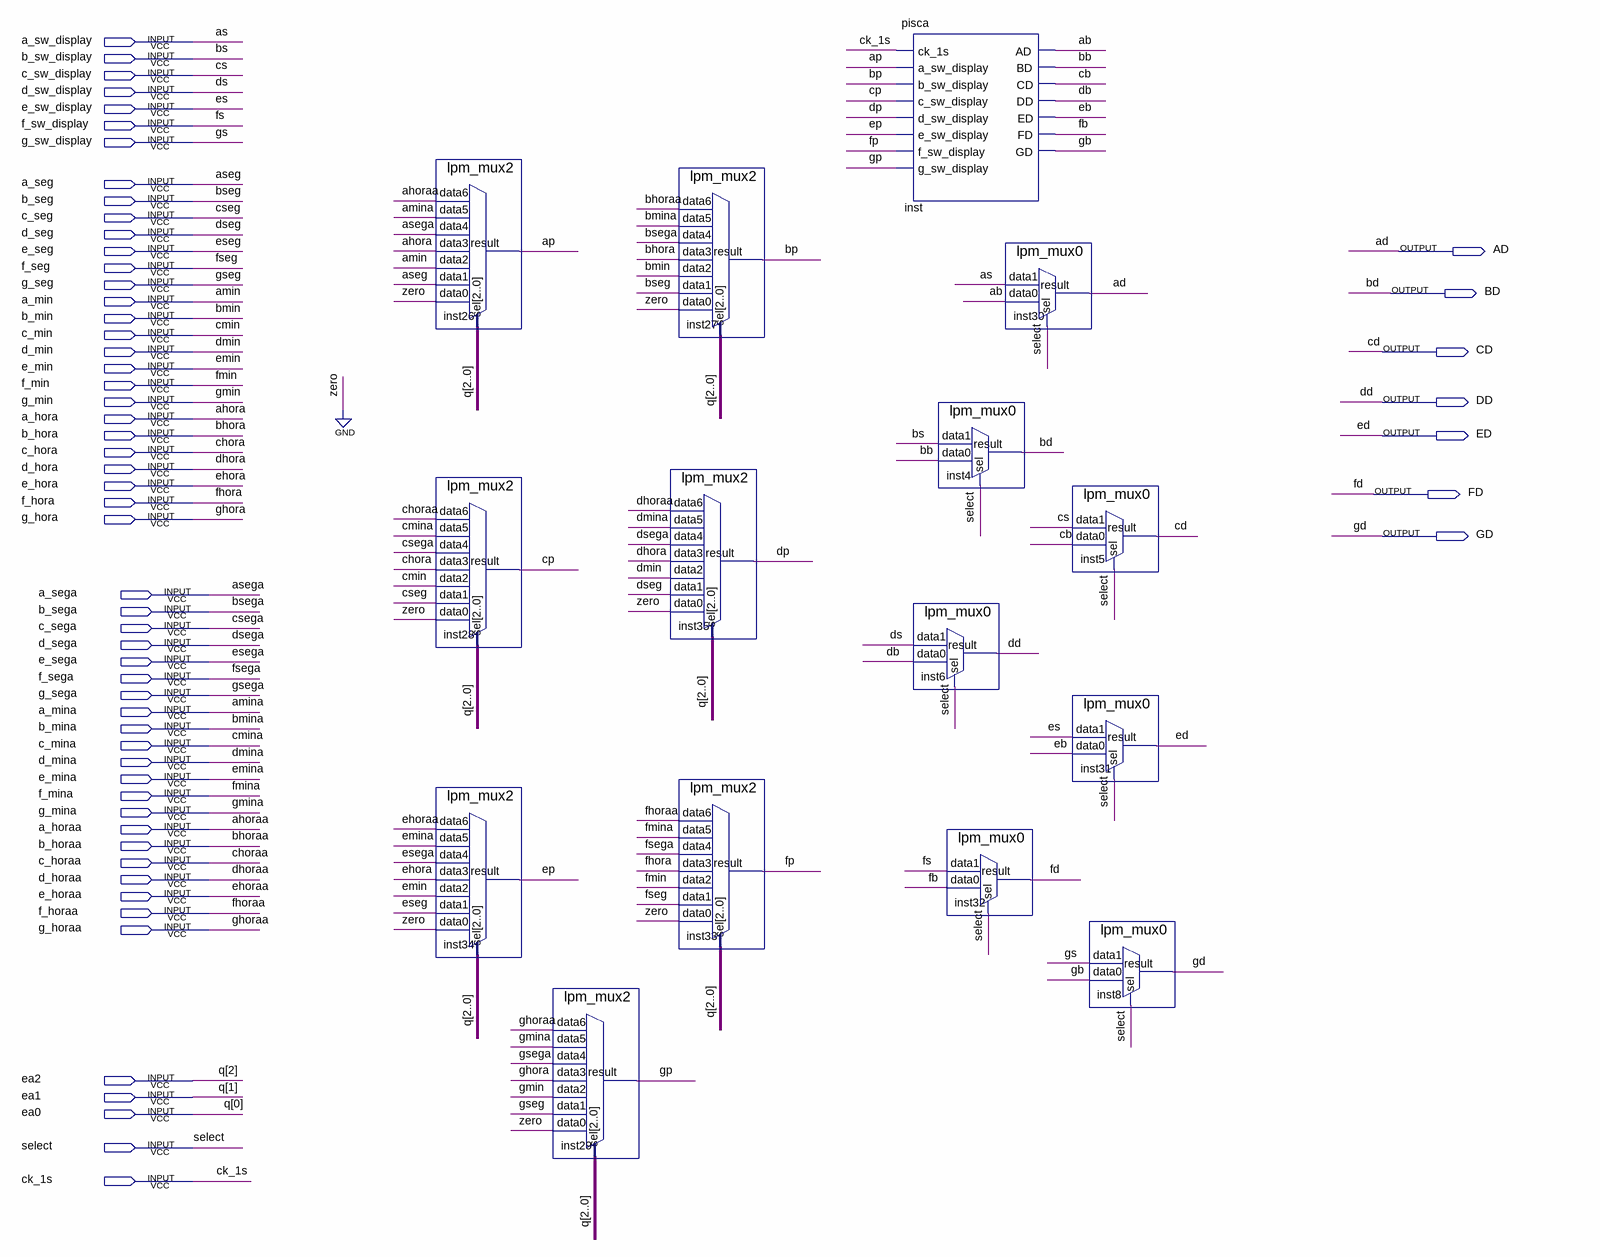
[diagram p0: schematic sheet]
// Quartus schematic select_display0_1.bdf as structural Verilog: 15 symbols, 61 pins
module select_display0_1 (
  input  a_sw_display,
  input  b_sw_display,
  input  c_sw_display,
  input  d_sw_display,
  input  e_sw_display,
  input  f_sw_display,
  input  g_sw_display,
  input  a_seg,
  input  b_seg,
  input  c_seg,
  input  d_seg,
  input  e_seg,
  input  f_seg,
  input  g_seg,
  input  a_min,
  input  b_min,
  input  c_min,
  input  d_min,
  input  e_min,
  input  f_min,
  input  g_min,
  input  a_hora,
  input  b_hora,
  input  c_hora,
  input  d_hora,
  input  e_hora,
  input  f_hora,
  input  g_hora,
  input  a_sega,
  input  b_sega,
  input  c_sega,
  input  d_sega,
  input  e_sega,
  input  f_sega,
  input  g_sega,
  input  a_mina,
  input  b_mina,
  input  c_mina,
  input  d_mina,
  input  e_mina,
  input  f_mina,
  input  g_mina,
  input  a_horaa,
  input  b_horaa,
  input  c_horaa,
  input  d_horaa,
  input  e_horaa,
  input  f_horaa,
  input  g_horaa,
  input  ea2,
  input  ea1,
  input  ea0,
  input  select,
  input  ck_1s,
  output AD,
  output BD,
  output CD,
  output DD,
  output ED,
  output FD,
  output GD
);

  wire ab, ap, bb, bp, cb, cp, db, dp, eb, ep, fb, fp, gb, gp;

  lpm_mux2 inst26 (
    .data6(a_horaa), .data5(a_mina), .data4(a_sega), .data3(a_hora), .data2(a_min), .data1(a_seg),
    .data0(1'b0), .sel({ea2, ea1, ea0}), .result(ap));
  lpm_mux2 inst28 (
    .data6(c_horaa), .data5(c_mina), .data4(c_sega), .data3(c_hora), .data2(c_min), .data1(c_seg),
    .data0(1'b0), .sel({ea2, ea1, ea0}), .result(cp));
  lpm_mux2 inst34 (
    .data6(e_horaa), .data5(e_mina), .data4(e_sega), .data3(e_hora), .data2(e_min), .data1(e_seg),
    .data0(1'b0), .sel({ea2, ea1, ea0}), .result(ep));
  lpm_mux2 inst29 (
    .data6(g_horaa), .data5(g_mina), .data4(g_sega), .data3(g_hora), .data2(g_min), .data1(g_seg),
    .data0(1'b0), .sel({ea2, ea1, ea0}), .result(gp));
  lpm_mux2 inst27 (
    .data6(b_horaa), .data5(b_mina), .data4(b_sega), .data3(b_hora), .data2(b_min), .data1(b_seg),
    .data0(1'b0), .sel({ea2, ea1, ea0}), .result(bp));
  lpm_mux2 inst35 (
    .data6(d_horaa), .data5(d_mina), .data4(d_sega), .data3(d_hora), .data2(d_min), .data1(d_seg),
    .data0(1'b0), .sel({ea2, ea1, ea0}), .result(dp));
  lpm_mux2 inst33 (
    .data6(f_horaa), .data5(f_mina), .data4(f_sega), .data3(f_hora), .data2(f_min), .data1(f_seg),
    .data0(1'b0), .sel({ea2, ea1, ea0}), .result(fp));
  pisca inst (
    .ck_1s(ck_1s), .a_sw_display(ap), .b_sw_display(bp), .c_sw_display(cp), .d_sw_display(dp),
    .e_sw_display(ep), .f_sw_display(fp), .g_sw_display(gp), .AD(ab), .BD(bb), .CD(cb), .DD(db), .ED(eb),
    .FD(fb), .GD(gb));
  lpm_mux0 inst4 (.data1(b_sw_display), .data0(bb), .sel(select), .result(BD));
  lpm_mux0 inst6 (.data1(d_sw_display), .data0(db), .sel(select), .result(DD));
  lpm_mux0 inst32 (.data1(f_sw_display), .data0(fb), .sel(select), .result(FD));
  lpm_mux0 inst30 (.data1(a_sw_display), .data0(ab), .sel(select), .result(AD));
  lpm_mux0 inst5 (.data1(c_sw_display), .data0(cb), .sel(select), .result(CD));
  lpm_mux0 inst31 (.data1(e_sw_display), .data0(eb), .sel(select), .result(ED));
  lpm_mux0 inst8 (.data1(g_sw_display), .data0(gb), .sel(select), .result(GD));

  // Other names for the same wires on the sheet: ahora = a_hora; ahoraa = a_horaa; amin = a_min; amina = a_mina;
  //   as = a_sw_display; aseg = a_seg; asega = a_sega; bhora = b_hora; bhoraa = b_horaa; bmin = b_min; bmina = b_mina;
  //   bs = b_sw_display; bseg = b_seg; bsega = b_sega; chora = c_hora; choraa = c_horaa; cmin = c_min; cmina = c_mina;
  //   cs = c_sw_display; cseg = c_seg; csega = c_sega; dhora = d_hora; dhoraa = d_horaa; dmin = d_min; dmina = d_mina;
  //   ds = d_sw_display; dseg = d_seg; dsega = d_sega; ehora = e_hora; ehoraa = e_horaa; emin = e_min; emina = e_mina;
  //   es = e_sw_display; eseg = e_seg; esega = e_sega; fhora = f_hora; fhoraa = f_horaa; fmin = f_min; fmina = f_mina;
  //   fs = f_sw_display; fseg = f_seg; fsega = f_sega; ghora = g_hora; ghoraa = g_horaa; gmin = g_min; gmina = g_mina;
  //   gs = g_sw_display; gseg = g_seg; gsega = g_sega; q[2:0] = {ea2, ea1, ea0}
endmodule
